# EAGLE design pdb2 (1) (EAGLE 9.5.1)
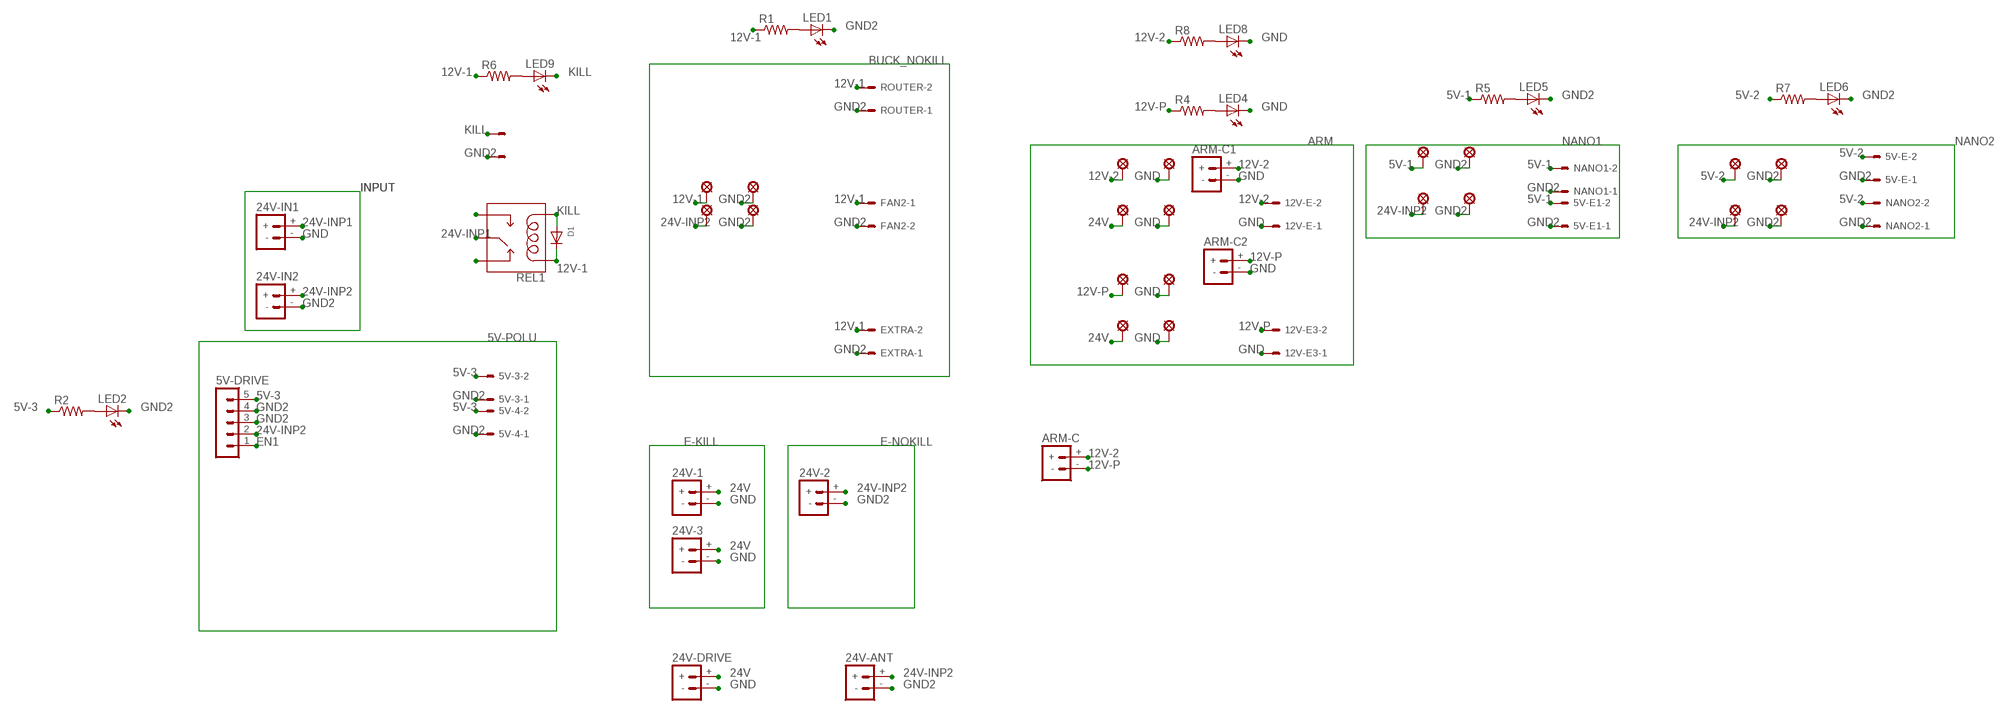
[diagram p0: schematic, sheet 1]

## Parts
5V-3  87758-0216  KK-156-2  [KK-156-2]
5V-4  87758-0216  KK-156-2  [KK-156-2]
5V-DRIVE  MA05-1  [MA05-1]
5V-E  87758-0216  KK-156-2  [KK-156-2]
5V-E1  87758-0216  KK-156-2  [KK-156-2]
12V-E  87758-0216  KK-156-2  [KK-156-2]
12V-E3  87758-0216  KK-156-2  [KK-156-2]
24V-1  BATTERY_CONN_DEANS  [DEANS]
24V-2  BATTERY_CONN_DEANS  [DEANS]
24V-3  BATTERY_CONN_DEANS  [DEANS]
24V-ANT  BATTERY_CONN_DEANS  [DEANS]
24V-DRIVE  BATTERY_CONN_DEANS  [DEANS]
24V-IN1  BATTERY_CONN_DEANS  [DEANS]
24V-IN2  BATTERY_CONN_DEANS  [DEANS]
ARM-C  BATTERY_CONN_DEANS  [DEANS]
ARM-C1  BATTERY_CONN_DEANS  [DEANS]
ARM-C2  BATTERY_CONN_DEANS  [DEANS]
D1  DIODEDO-1N4148  [DO-1N4148]
EXTRA  87758-0216  KK-156-2  [KK-156-2]
FAN2  87758-0216  KK-156-2  [KK-156-2]
KILLSWCH  87758-0216  KK-156-2  [KK-156-2]
LED1  LEDB152  [Q62902-B152]
LED2  LEDB152  [Q62902-B152]
LED4  LEDB152  [Q62902-B152]
LED5  LEDB152  [Q62902-B152]
LED6  LEDB152  [Q62902-B152]
LED8  LEDB152  [Q62902-B152]
LED9  LEDB152  [Q62902-B152]
LSP5  LSP10  [LSP10]
LSP6  LSP10  [LSP10]
LSP7  LSP10  [LSP10]
LSP8  LSP10  [LSP10]
LSP9  LSP10  [LSP10]
LSP10  LSP10  [LSP10]
LSP11  LSP10  [LSP10]
LSP12  LSP10  [LSP10]
LSP13  LSP10  [LSP10]
LSP14  LSP10  [LSP10]
LSP15  LSP10  [LSP10]
LSP16  LSP10  [LSP10]
LSP17  LSP10  [LSP10]
LSP18  LSP10  [LSP10]
LSP19  LSP10  [LSP10]
LSP20  LSP10  [LSP10]
LSP29  LSP10  [LSP10]
LSP30  LSP10  [LSP10]
LSP31  LSP10  [LSP10]
LSP32  LSP10  [LSP10]
NANO1  87758-0216  KK-156-2  [KK-156-2]
NANO2  87758-0216  KK-156-2  [KK-156-2]
R1  R-US_0207/7  [0207/7]
R2  R-US_0207/7  [0207/7]
R4  R-US_0207/7  [0207/7]
R5  R-US_0207/7  [0207/7]
R6  R-US_0207/7  [0207/7]
R7  R-US_0207/7  [0207/7]
R8  R-US_0207/7  [0207/7]
REL1  RELAY-SPDT-JQX-15F  [RELAY-T90]
ROUTER  5566-2  KK-156-2  [KK-156-2]

## Nets
5V-1: 5V-E1.2 LSP17.MP NANO1.2 R5.1
5V-2: 5V-E.2 LSP29.MP NANO2.2 R7.1
5V-3: 5V-3.2 5V-4.2 5V-DRIVE.5 R2.1
12V-1: D1.C EXTRA.2 FAN2.1 LSP5.MP R1.1 R6.1 REL1.COIL1 ROUTER.2
12V-2: 12V-E.2 ARM-C1.+ ARM-C.+ LSP10.MP R8.1
12V-P: 12V-E3.2 ARM-C2.+ ARM-C.- LSP13.MP R4.1
24V: 24V-1.+ 24V-3.+ 24V-DRIVE.+ LSP9.MP LSP15.MP REL1.NO
24V-INP1: 24V-IN1.+ REL1.MAIN
24V-INP2: 5V-DRIVE.2 24V-2.+ 24V-ANT.+ 24V-IN2.+ LSP8.MP LSP19.MP LSP31.MP
EN1: 5V-DRIVE.1
GND: 12V-E3.1 12V-E.1 24V-1.- 24V-3.- 24V-DRIVE.- 24V-IN1.- ARM-C1.- ARM-C2.- LED4.K(C) LED8.K(C) LSP11.MP LSP12.MP LSP14.MP LSP16.MP
GND2: 5V-3.1 5V-4.1 5V-DRIVE.3 5V-DRIVE.4 5V-E1.1 5V-E.1 24V-2.- 24V-ANT.- 24V-IN2.- EXTRA.1 FAN2.2 KILLSWCH.2 LED1.K(C) LED2.K(C) LED5.K(C) LED6.K(C) LSP6.MP LSP7.MP LSP18.MP LSP20.MP LSP30.MP LSP32.MP NANO1.1 NANO2.1 ROUTER.1
KILL: D1.A KILLSWCH.1 LED9.K(C) REL1.COIL2
N$1: LED2.A R2.2
N$2: REL1.NC
N$3: LED4.A R4.2
N$4: LED5.A R5.2
N$5: LED9.A R6.2
N$6: LED6.A R7.2
N$7: LED8.A R8.2
N$8: LED1.A R1.2

## Library data of the parts
5V-3 5V-4 5V-E 5V-E1 12V-E 12V-E3 EXTRA FAN2 KILLSWCH NANO1 NANO2 ROUTER = con-molex:KK-156-2: KK 156 HEADER Source: http://www.molex.com/pdm_docs/sd/026604100_sd.pdf; MF: MOLEX; OC_FARNELL: unknown; OC_NEWARK: unknown
5V-DRIVE = con-lstb:MA05-1: PIN HEADER; OC_FARNELL: unknown; OC_NEWARK: unknown
24V-1-24V-3 24V-ANT 24V-DRIVE 24V-IN1 24V-IN2 ARM-C ARM-C1 ARM-C2 = SparkFun-Connectors:BATTERY_CONN: Battery Connectors Various footprints for battery connections SparkFun Products: Deans Connector -M/F Pair <https://www.sparkfun.com/products/11864>; SF_ID: PRT-11864
D1 = adafruit:DIODE: Diode SMADIODE - SMA Surface Mount Package 20V 1A Schottky Diode Digikey: 641-1014-6-ND DO-1N4148 - Through Hole Small Current Diode SOD-123 20V 1 A (.5mV Vf) Schottky Diode - Digikey: MBRX120TPMSCT-ND SOD-323 10V 570mA (.38mV Vf, 3ns) Schottky Diode - Digikey: ZLLS410CT-ND SOD-523 30V 30mA Schottky Diode (RB751S-40TE61) - Digikey: RB751S-40TE61CT-ND SOT23-R/W - SOT23 Package (R = Solder Paste/Reflow Ovens, W = Hand-Soldering) BAT54Film 40V 300mA - Digikey: 497-7162-1-ND
LED1 LED2 LED4-LED6 LED8 LED9 = adafruit:LED: LED OSRAM: - CHIPLED LG R971, LG N971, LY N971, LG Q971, LY Q971, LO R971, LY R971 LH N974, LH R974 LS Q976, LO Q976, LY Q976 LO Q996 - Hyper CHIPLED LW Q18S LB Q993, LB Q99A, LB R99A - SideLED LS A670, LO A670, LY A670, LG A670, LP A670 LB A673, LV A673, LT A673, LW A673 LH A674 LY A675 LS A676, LA A676, LO A676, LY A676, LW A676 LS A679, LY A679, LG A679 - Hyper Micro SIDELED® LS Y876, LA Y876, LO Y876, LY Y876 LT Y87S - SmartLED LW L88C, LW L88S LB L89C, LB L89S, LG L890 LS L89K, LO L89K, LY L89K LS L896, LA L896, LO L896, LY L896 - TOPLED LS T670, LO T670, LY T670, LG T670, LP T670 LSG T670, LSP T670, LSY T670, LOP T670, LYG T670 LG T671, LOG T671, LSG T671 LB T673, LV T673, LT T673, LW T673 LH T674 LS T676, LA T676, LO T676, LY T676, LB T676, LH T676, LSB T676, LW T676 LB T67C, LV T67C, LT T67C, LS T67K, LO T67K, LY T67K, LW E67C LS E67B, LA E67B, LO E67B, LY E67B, LB E67C, LV E67C, LT E67C LW T67C LS T679, LY T679, LG T679 LS T770, LO T770, LY T770, LG T770, LP T770 LB T773, LV T773, LT T773, LW T773 LH T774 LS E675, LA E675, LY E675, LS T675 LS T776, LA T776, LO T776, LY T776, LB T776 LHGB T686 LT T68C, LB T68C - Hyper Mini TOPLED® LB M676 - Mini TOPLED Santana® LG M470 LS M47K, LO M47K, LY M47K Source: http://www.osram.convergy.de/
LSP5-LSP20 LSP29-LSP32 = solpad:LSP10: SOLDER PAD drill 1.0 mm, distributor Buerklin, 12H555
R1 R2 R4-R8 = rcl:R-US_: RESISTOR, American symbol; SPICEPREFIX: R
REL1 = SparkFun-Electromechanical:RELAY-SPDT: SPDT Electromechanical Relay Single-pole, double-throw sealed relays. When current is applied to the coil, it throws a simple changeover switch, terminating the connection from the NC contact to ground and closing the NO contact. Use them to switch high voltage/high current devices. SparkFun Products JQX-15F: Relay SPDT Sealed - 20A <https://www.sparkfun.com/products/10924> (COM-10924) JZC-11F: Relay SPDT Sealed <https://www.sparkfun.com/products/100> (COM-00100); PROD_ID: COMP-10736; SF_SKU: COM-10924

## Board
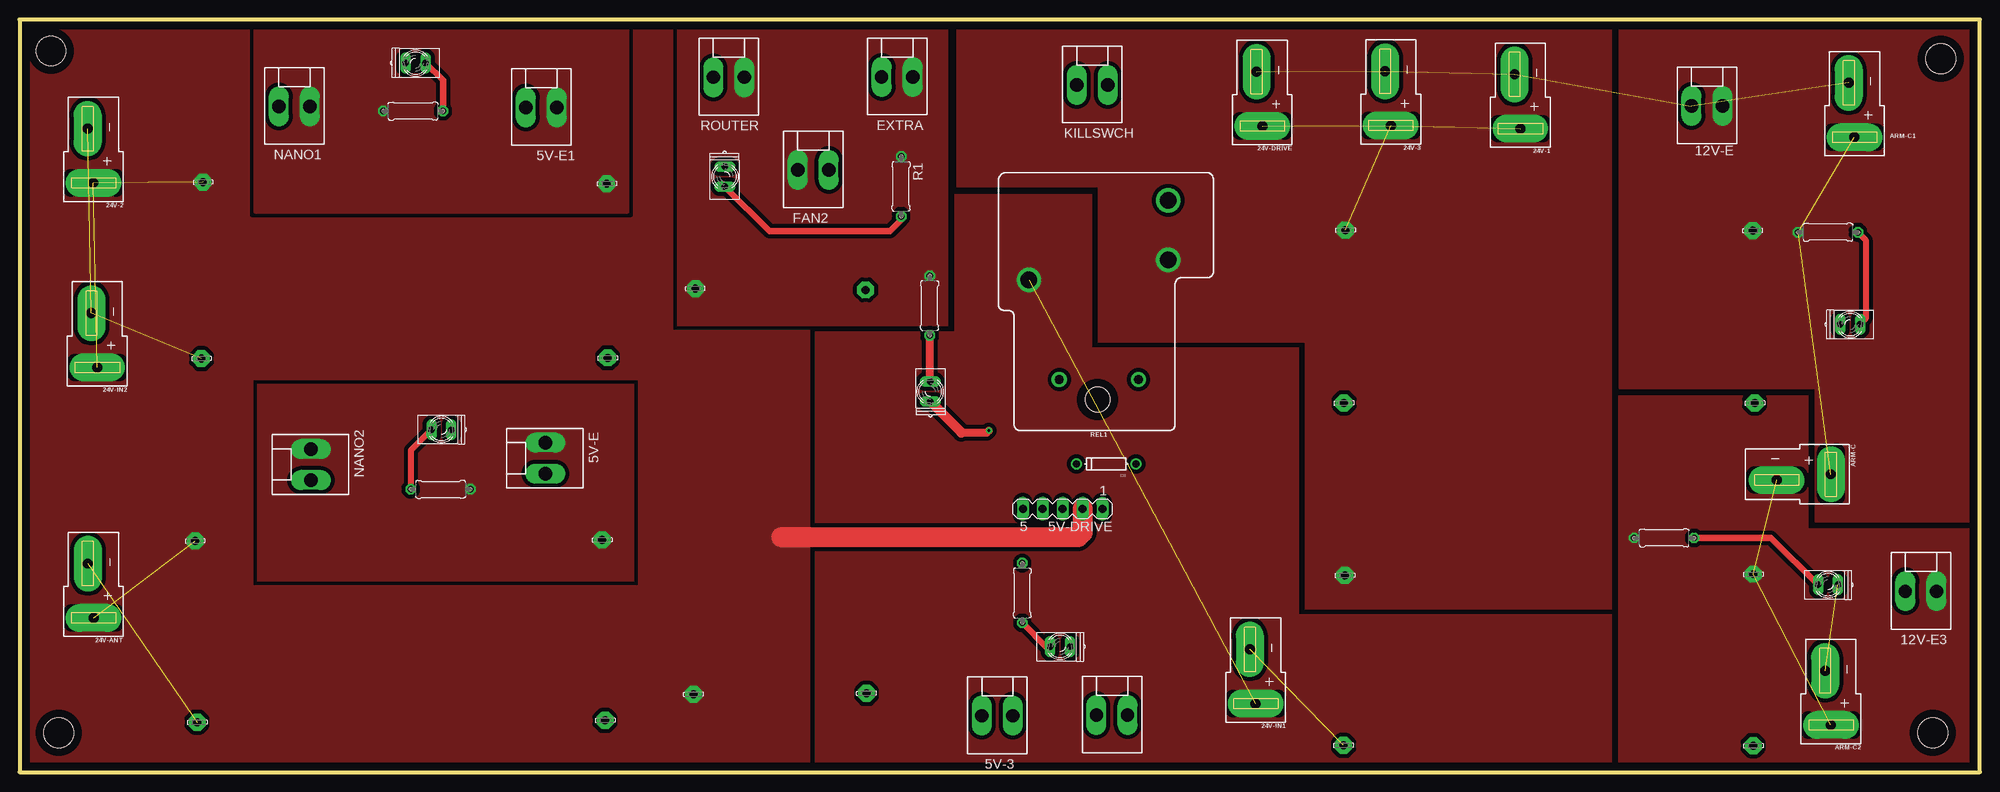
[diagram p1: board, top side]
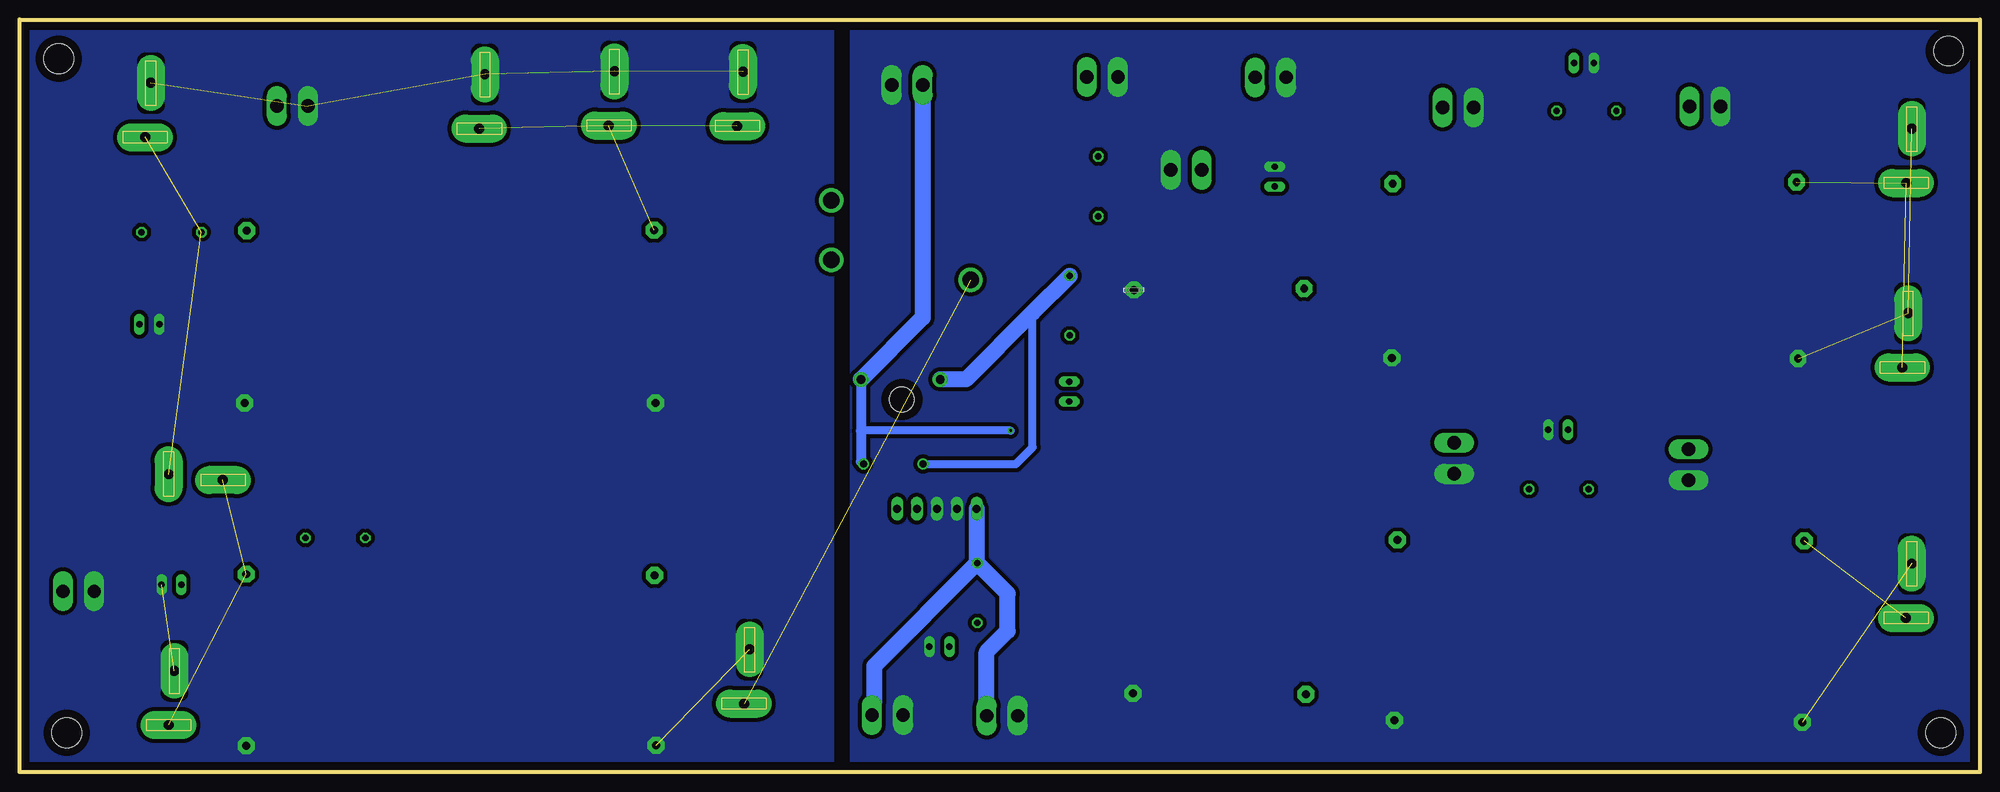
[diagram p2: board, bottom side, seen from below]

Size 250 x 96 mm. Coordinates in mm from the lower left corner, seen from the top.
Outline: 0,0 250,0 250,96 0,96 0,0
Copper layers (1*16): Top 0.035mm / dielectric 1.5mm / Bottom 0.035mm
Design rules "default *": minimum track width 6mil, minimum drill 0.35mm, track to track 20mil, track to pad 20mil, pad to pad 20mil, via to via 20mil, smd to smd 20mil, copper to edge 40mil, drill to drill 6mil, minimum pad ring 10mil, minimum via ring 8mil, stop-mask expansion 4mil, vias tented up to drill 0mil, thermal gap 10mil
Holes 3.81 mm at 4,92 5,5 244,5 245,91
Holes 3.17 mm at 137.48,47.54

### Footprints (pad centres in the part's own frame; a part is rotated, then mirrored left to right if it is on the bottom)
KK-156-2 = drill 1.7 pad 2.184 long: 1 -1.98,0; 2 1.98,0
MA05-1 = drill 1.016 long: 1 -5.08,0; 2 -2.54,0; 3 0,0; 4 2.54,0; 5 5.08,0
DEANS = drill 1.27 pad 3.556 long: + 0,0; - 0.737,-6.921
DO-1N4148 = drill 0.9: A -3.81,0; C 3.81,0
Q62902-B152 = drill 0.813 long: A 1.27,0; K -1.27,0
LSP10 = drill 1.016 pad 2.159 octagon: MP 0,0
0207/7 = drill 0.813 octagon: 1 -3.81,0; 2 3.81,0
RELAY-T90 = drill 1.1 pad 1.956: COIL1 0,-13.9; COIL2 0,-3.81 | drill 2.1: MAIN -12.7,-17.78; NC -22.86,0; NO -15.24,0

### Placement (x,y rotation side)
5V-3  124.69,7.18 0 top
5V-4  139.31,7.26 0 top
5V-DRIVE  133.02,33.59 180 top
5V-E  67.06,40.04 90 top
5V-E1  66.53,84.81 0 top
12V-E  215.2,84.97 0 top
12V-E3  242.47,23.06 0 top
24V-1  191.4,82.09 180 top
24V-2  9.42,75.17 180 top
24V-3  174.87,82.49 180 top
24V-ANT  9.43,19.67 180 top
24V-DRIVE  158.48,82.43 180 top
24V-IN1  157.64,8.74 180 top
24V-IN2  9.9,51.62 180 top
ARM-C  231,38 270 top
ARM-C1  234,81 180 top
ARM-C2  231,6 180 top
D1  138.58,39.3 180 top
EXTRA  111.91,88.66 0 top
FAN2  101.21,76.84 0 top
KILLSWCH  136.81,87.68 0 top
LED1  89.92,75.97 270 top
LED2  132.7,16 180 top
LED4  230.63,23.89 180 top
LED5  50.5,90.46 0 top
LED6  53.79,43.7 180 top
LED8  233.45,57.11 0 top
LED9  116.16,48.54 90 top
LSP5  86.18,61.67 180 top
LSP6  107.91,61.52 180 bottom
LSP7  108.01,10.04 180 top
LSP8  85.98,9.94 180 top
LSP9  169.11,69.12 0 top
LSP10  221.04,69.09 180 top
LSP11  221.28,47.11 0 top
LSP12  168.92,47.1 0 top
LSP13  221.11,25.25 0 top
LSP14  221.1,3.38 0 top
LSP15  169.01,25.09 0 top
LSP16  168.84,3.4 0 top
LSP17  74.89,75.09 0 top
LSP18  74.99,52.85 0 top
LSP19  23.38,75.24 0 top
LSP20  23.19,52.74 0 top
LSP29  74.27,29.61 0 top
LSP30  74.64,6.58 0 top
LSP31  22.37,29.5 0 top
LSP32  22.64,6.37 0 top
NANO1  35.03,84.94 0 top
NANO2  37.14,39.23 90 top
R1  112.42,74.72 270 top
R2  127.87,22.85 270 top
R4  209.73,29.87 0 top
R5  50.18,84.33 0 top
R6  116.07,59.52 270 top
R7  53.69,36.08 180 top
R8  230.63,68.87 0 top
REL1  146.51,50.09 270 top
ROUTER  90.45,88.65 0 top

### Tracks (layer width: path | path; a pad name or v marks a point on that pad's centre or on a via)
5V-1
  pour Top (no thermals): 30.16,96 30.16,71.62 77.43,71.62 77.43,96
5V-2
  pour Top (no thermals): 30.3,49.46 30.3,24.41 78.38,24.41 78.38,49.46
5V-3
  Bottom 2.032: 5V-DRIVE.5 127.94,26.72 R2.1 | 5V-3.2 126.67,15.33 124,18 124,22.79 R2.1 | 5V-4.2 141.29,8.71 141,9 141,13.53 R2.1
12V-1
  Bottom 1.016: D1.C 122.93,39.3 120.8,41.44 120.8,58.6
  Bottom 2.032: R6.1 120.8,58.6 129.31,50.09 REL1.COIL1
  pour Top (no thermals): 83.84,96 83.84,56.95 118.41,56.95 118.41,96
12V-2  (2 unrouted)
  pour Top (no thermals): 204,96 204,49 229,49 229,32 251,32 251,95 250,96
12V-P  (2 unrouted)
  pour Top (no thermals): 204,48 228,48 228,31 251,31 251,-2 204,-2
24V  (3 unrouted)
  pour Top (no thermals): 119.49,74.69 137.53,74.69 137.53,54.88 163.94,54.88 163.94,20.84 203.06,20.84 203.06,102.89 202.81,103.14 119.49,103.14
24V-INP1  (1 unrouted)
  pour Top (no thermals): 101.46,56.15 101.46,-0.75 203.06,-0.75 203.06,20.08 163.18,20.08 163.18,54.12 136.77,54.12 136.77,73.68 119.24,73.68 119.24,56.15
24V-INP2  (3 unrouted)
  Top 2.54: 5V-DRIVE.2 135.56,30.53 134.98,29.95 97.18,29.95 97.14,29.99
  pour Top (rank 3, no thermals): 0.37,95.52 100.75,95.52 100.75,0.02 -0.14,0.02 -0.14,95.01
GND  (6 unrouted)
  pour Bottom (no thermals): 146.21,96 146.21,0 250,0 250,95 249,96
GND2  (3 unrouted)
  pour Bottom (no thermals): -0.17,96 -0.17,0 144,0 144,96
KILL  (via drill 0.35)
  Top 1.016: 120.12,43.31 123.34,43.31 v123.61,43.58
  Top 1.27: LED9.K 120.12,43.31
  Bottom 1.016: v123.61,43.58 142.7,43.58
  Bottom 1.27: REL1.COIL2 142.7,43.58 142.7,39.61 D1.A
  Bottom 2.032: KILLSWCH.1 134.83,57.96 REL1.COIL2
N$1
  Top 0.813: LED2.A 130.91,16 R2.2
N$3
  Top 0.813: LED4.A 223.36,29.89 213.56,29.89 R4.2
N$4
  Top 0.813: LED5.A 53.99,88.25 R5.2
N$5
  Top 1.016: R6.2 116.07,49.9 LED9.A
N$6
  Top 0.762: LED6.A 49.88,41.06 R7.2
N$7
  Top 0.762: R8.2 235.44,67.87 235.44,57.84 LED8.A
N$8
  Top 0.813: LED1.A 95.63,69 111,69 112.42,70.42 R1.2